# EAGLE design Atmega32_test (EAGLE 6.5.0)
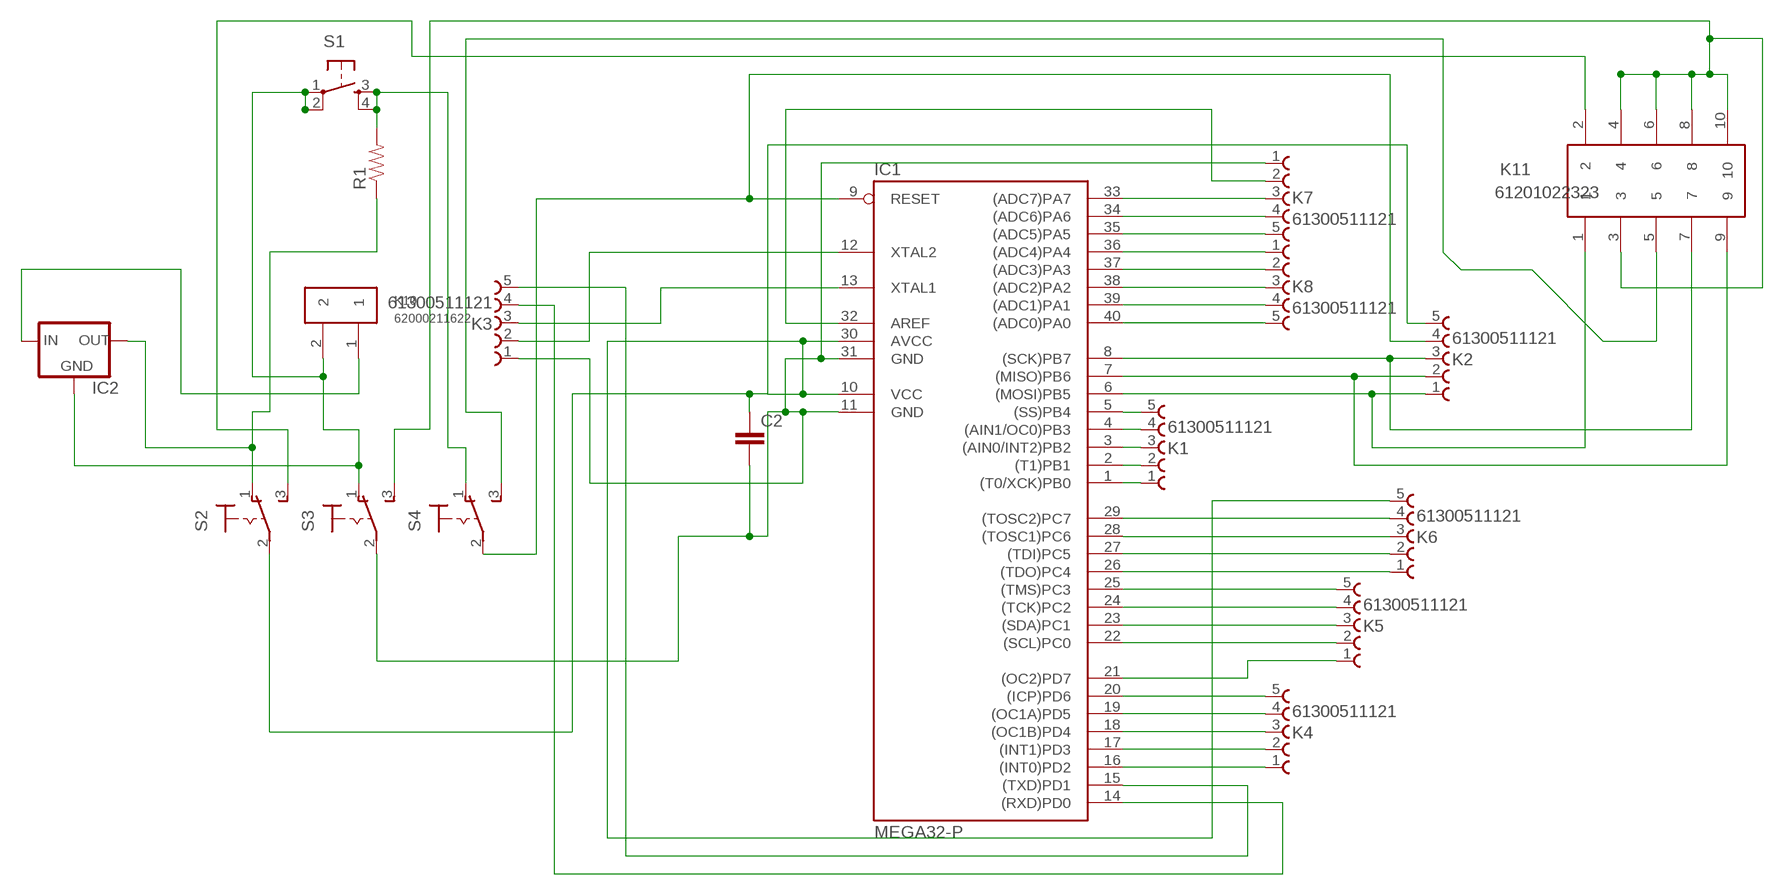
[diagram p0: schematic, sheet 1]

## Parts
C2  C10/6  [C10B6]
IC1  MEGA32-P  [DIL40]
IC2  V_REG_78XX-TO-220  [TO-220-ALT]
K1  61300511121  [61300511121]
K2  61300511121  [61300511121]
K3  61300511121  [61300511121]
K4  61300511121  [61300511121]
K5  61300511121  [61300511121]
K6  61300511121  [61300511121]
K7  61300511121  [61300511121]
K8  61300511121  [61300511121]
K10  62000211622  [62000211622]
K11  61201022323  [61201022323]
R1  10KOHM1/6W5%(PTH)KIT  [AXIAL-0.3-KIT]
S1  TAC_SWITCHPTH  [TACTILE-PTH]
S2  320-916  [320-916]
S3  320-916  [320-916]
S4  320-916  [320-916]

## Nets
N$1: IC1.12(XTAL2) K3.2
N$2: IC1.26((TDO)PC4) K6.1
N$3: IC1.1((T0/XCK)PB0) K1.1
N$4: IC1.5((SS)PB4) K1.5
N$5: IC1.3((AIN0/INT2)PB2) K1.3
N$6: IC1.4((AIN1/OC0)PB3) K1.4
N$7: IC1.2((T1)PB1) K1.2
N$8: IC1.6((MOSI)PB5) K2.1 K11.1
N$9: IC1.7((MISO)PB6) K2.2 K11.9
N$10: IC1.8((SCK)PB7) K2.3 K11.7
N$11: IC1.39((ADC1)PA1) K8.4
N$12: C2.2 IC1.11(GND) IC1.31(GND) K3.1 K7.1 S3.2(P)
N$13: IC1.9(RESET) K2.4 S4.2(P)
N$14: K11.2 S2.3(S)
N$15: IC1.14((RXD)PD0) K3.4
N$16: IC2.IN K10.1
N$17: IC1.17((INT1)PD3) K4.2
N$18: IC1.16((INT0)PD2) K4.1
N$19: IC1.18((OC1B)PD4) K4.3
N$20: IC1.19((OC1A)PD5) K4.4
N$21: IC1.20((ICP)PD6) K4.5
N$22: IC1.21((OC2)PD7) K5.1
N$23: IC1.22((SCL)PC0) K5.2
N$24: IC1.23((SDA)PC1) K5.3
N$25: IC1.24((TCK)PC2) K5.4
N$26: IC1.25((TMS)PC3) K5.5
N$27: IC1.27((TDI)PC5) K6.2
N$28: IC1.28((TOSC1)PC6) K6.3
N$29: IC1.29((TOSC2)PC7) K6.4
N$31: IC1.13(XTAL1) K3.3
N$32: IC1.32(AREF) K7.2
N$34: IC1.36((ADC4)PA4) K8.1
N$35: IC1.33((ADC7)PA7) K7.3
N$36: IC1.34((ADC6)PA6) K7.4
N$37: IC1.35((ADC5)PA5) K7.5
N$38: IC1.37((ADC3)PA3) K8.2
N$39: IC1.38((ADC2)PA2) K8.3
N$40: IC1.40((ADC0)PA0) K8.5
N$41: IC2.OUT R1.P$1 S2.1(O)
N$42: R1.P$2 S1.3 S1.4 S4.1(O)
N$43: K11.3 K11.4 K11.6 K11.8 K11.10 S3.3(S)
N$44: IC2.GND K10.2 S1.1 S1.2 S3.1(O)
N$45: K11.5 S4.3(S)
N$46: IC1.15((TXD)PD1) K3.5
N$48: C2.1 IC1.10(VCC) IC1.30(AVCC) K2.5 K6.5 S2.2(P)

## Library data of the parts
C2 = capacitor-wima:C: CAPACITOR naming: grid - package width
IC1 = atmel:MEGA32-P: MICROCONTROLLER 32 Kbytes FLASH 2 Kbytes SRAM 1 Kbytes EEPROM USART 8-channel 10 bit ADC Source: www.atmel.com .. doc2503.pdf; MPN: ATMEGA32-16PU; OC_FARNELL: 1661729; OC_NEWARK: 51P1794
IC2 = SparkFun-PowerIC:V_REG_78XX: Voltage Regulator Standard 7805 5V regulator. IGO (Input Ground Output). Spark Fun Electronics SKU : COM-00107
K1-K8 = Wuerth_Elektronik_eiCan_01_Pin__Socked_Headers_v1_3:61300511121: WR-PHD 2.54mm Pin Header, 5 Pin
K10 = Wuerth_Elektronik_eiCan_09_Wire_to_Board_Connectors:62000211622: WR-WTB 2.00mm Male Vertical Shrouded Header, 2 Pins
K11 = Wuerth_Elektronik_eiCan_05_Box_Header_IDC_Connectors_1_2:61201022323: WR-BHD 2.54mm Board to Cable Transition Connector, 10 Pins
R1 = SparkFun-Resistors:10KOHM1/6W5%(PTH): RES-08375; PROD_ID: RES-08375
S1 = SparkFun-Electromechanical:TAC_SWITCH: Momentary Switch Button commonly used for reset or general input. Spark Fun Electronics SKU : COM-00097 SMT- SWCH-08247
S2-S4 = switch:320-916: TOGGLE SWITCH distributor RS Components

## Board
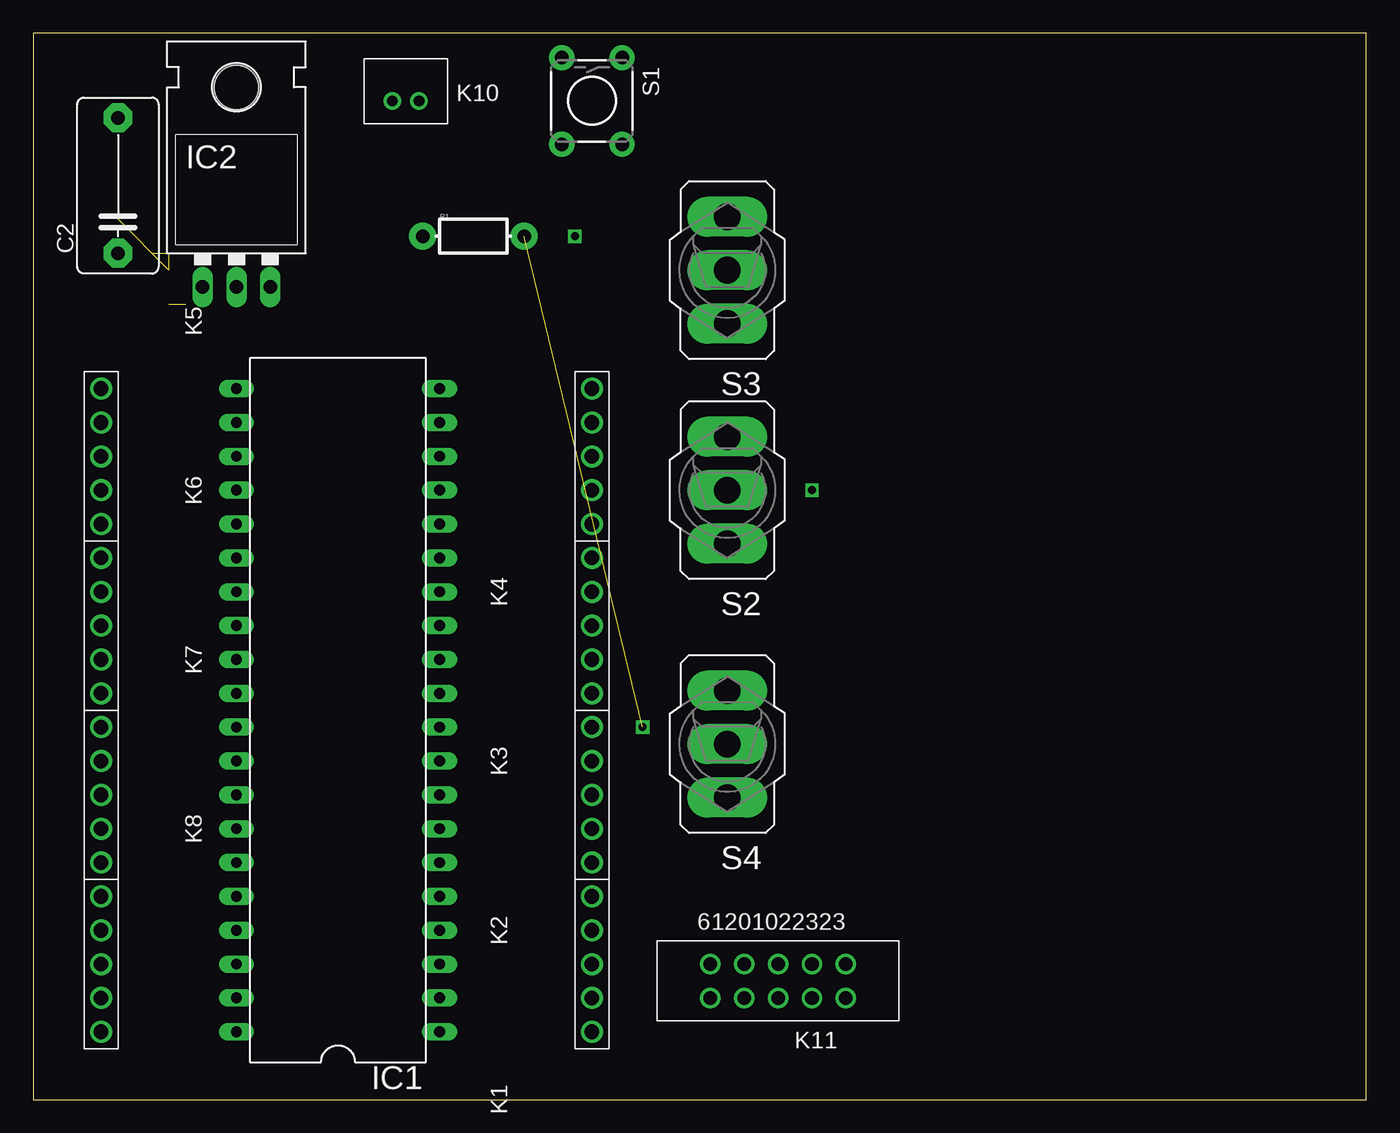
[diagram p1: board, top side]
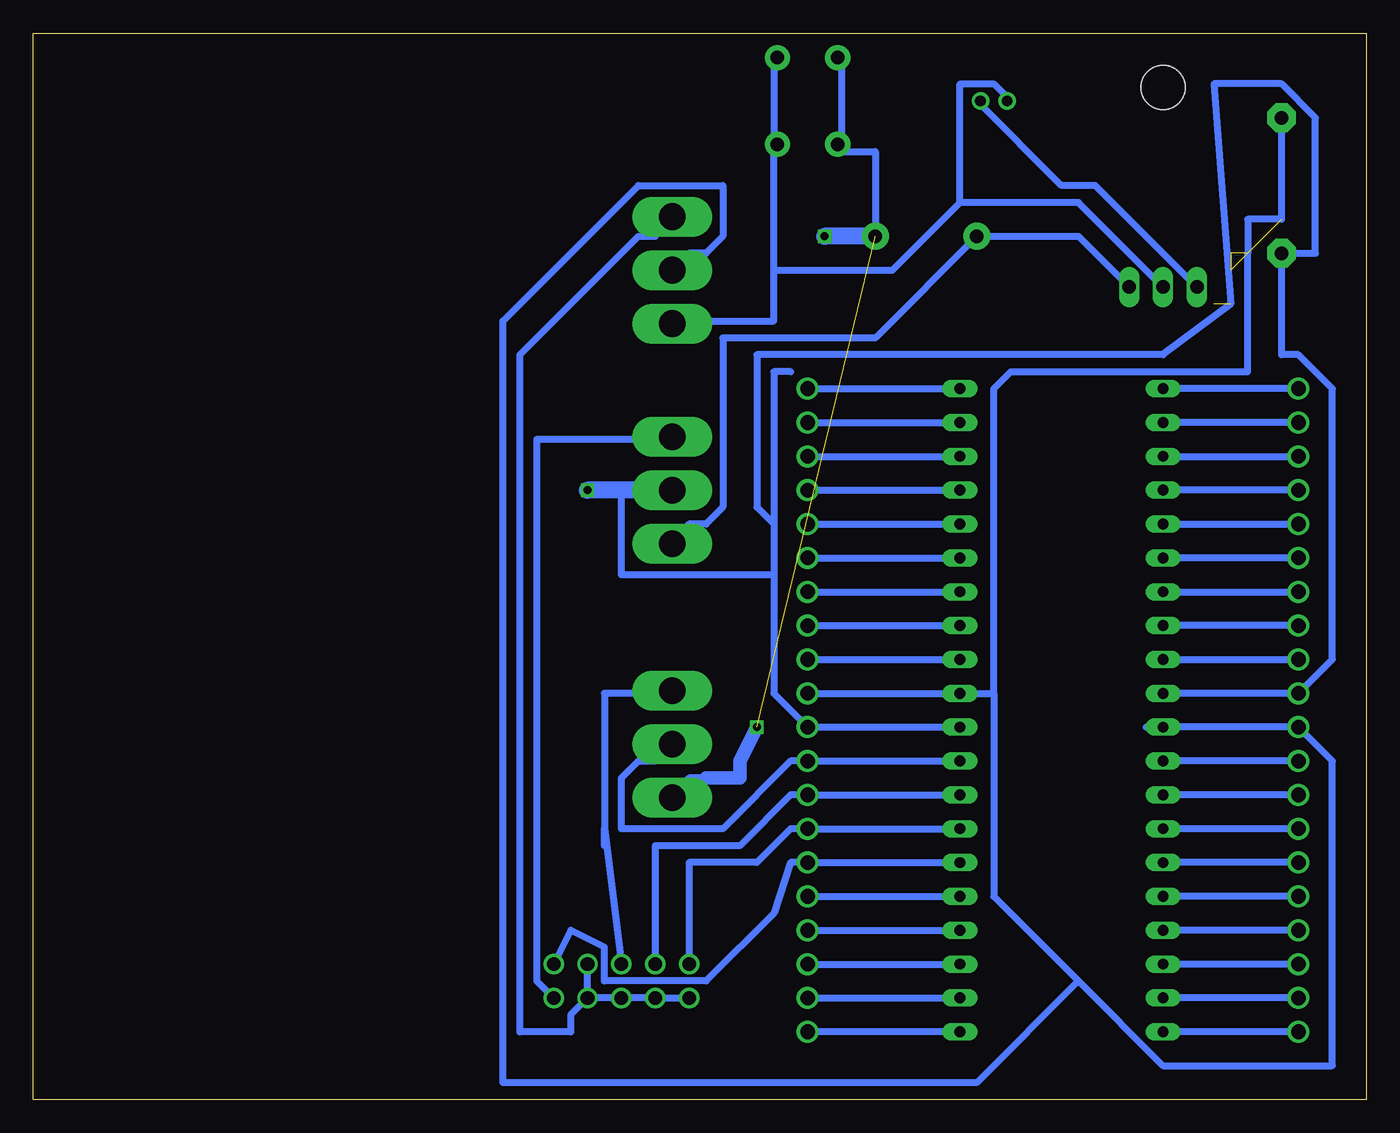
[diagram p2: board, bottom side, seen from below]

Size 100 x 80 mm. Coordinates in mm from the lower left corner, seen from the top.
Outline: 0,0 100,0 100,80 0,80 0,0
Copper layers (1*16): Top 0.035mm / dielectric 1.5mm / Bottom 0.035mm
Design rules "default *": minimum track width 20mil, minimum drill 24mil, track to track 15mil, track to pad 8mil, pad to pad 8mil, via to via 8mil, smd to smd 8mil, copper to edge 40mil, drill to drill 8mil, minimum pad ring 10mil, minimum via ring 8mil, stop-mask expansion 4mil, vias tented up to drill 0mil, thermal gap 10mil

### Footprints (pad centres in the part's own frame; a part is rotated, then mirrored left to right if it is on the bottom)
C10B6 = drill 1.016 pad 2.159 octagon: 1 -5.08,0; 2 5.08,0
DIL40 = drill 0.813 long: 1 -24.13,-7.62; 2 -21.59,-7.62; 3 -19.05,-7.62; 4 -16.51,-7.62; 5 -13.97,-7.62; 6 -11.43,-7.62; 7 -8.89,-7.62; 8 -6.35,-7.62; 9 -3.81,-7.62; 10 -1.27,-7.62; 11 1.27,-7.62; 12 3.81,-7.62; 13 6.35,-7.62; 14 8.89,-7.62; 15 11.43,-7.62; 16 13.97,-7.62; 17 16.51,-7.62; 18 19.05,-7.62; 19 21.59,-7.62; 20 24.13,-7.62; 21 24.13,7.62; 22 21.59,7.62; 23 19.05,7.62; 24 16.51,7.62; 25 13.97,7.62; 26 11.43,7.62; 27 8.89,7.62; 28 6.35,7.62; 29 3.81,7.62; 30 1.27,7.62; 31 -1.27,7.62; 32 -3.81,7.62; 33 -6.35,7.62; 34 -8.89,7.62; 35 -11.43,7.62; 36 -13.97,7.62; 37 -16.51,7.62; 38 -19.05,7.62; 39 -21.59,7.62; 40 -24.13,7.62
TO-220-ALT = drill 1.016 long: GND 0,-3.81; IN -2.54,-3.81; OUT 2.54,-3.81 | hole 3.302: 0,11.176
61300511121 = drill 1.1: 1 -5.08,0; 2 -2.54,0; 3 0,0; 4 2.54,0; 5 5.08,0
62000211622 = drill 0.8: 1 1,0; 2 -1,0
61201022323 = drill 1.02: 1 -2.54,-1.27; 2 -2.54,1.27; 3 0,-1.27; 4 0,1.27; 5 2.54,-1.27; 6 2.54,1.27; 7 5.08,-1.27; 8 5.08,1.27; 9 7.62,-1.27; 10 7.62,1.27
AXIAL-0.3-KIT = drill 1.016 pad 2.032: P$1 -3.81,0; P$2 3.81,0
TACTILE-PTH = drill 1.016 pad 1.88: 1 -3.251,2.261; 2 3.251,2.261; 3 -3.251,-2.261; 4 3.251,-2.261
320-916 = drill 2.007 long: 1 0,4.013; 2 0,0; 3 0,-4.013

### Placement (x,y rotation side)
C2  6.35,68.58 90 top
IC1  22.86,29.21 90 top
IC2  15.24,64.77 0 top
K1  41.91,10.16 90 top
K2  41.91,22.86 90 top
K3  41.91,35.56 90 top
K4  41.91,48.26 90 top
K5  5.08,48.26 270 top
K6  5.08,35.56 270 top
K7  5.08,22.86 270 top
K8  5.08,10.16 270 top
K10  27.94,74.93 0 top
K11  58.42,8.89 180 top
R1  33.02,64.77 0 top
S1  41.91,74.93 270 top
S2  52.07,45.72 180 top
S3  52.07,62.23 180 top
S4  52.07,26.67 180 top

### Tracks (layer width: path | path; a pad name or v marks a point on that pad's centre or on a via)
N$1
  Bottom 0.508: K3.2 IC1.12
N$2
  Bottom 0.508: K6.1 IC1.26
N$3
  Bottom 0.508: IC1.1 K1.1
N$4
  Bottom 0.508: K1.5 IC1.5
N$5
  Bottom 0.508: K1.3 IC1.3
N$6
  Bottom 0.508: K1.4 IC1.4
N$7
  Bottom 0.508: K1.2 IC1.2
N$8
  Bottom 0.508: IC1.6 K2.1 43.18,17.78 44.45,13.97 49.53,8.89 57.15,8.89 57.15,11.43 59.69,12.7 K11.1
N$9
  Bottom 0.508: IC1.7 K2.2 43.18,20.32 45.72,17.78 50.8,17.78 K11.9
N$10
  Bottom 0.508: IC1.8 K2.3 43.18,22.86 46.99,19.05 53.34,19.05 K11.7
N$11
  Bottom 0.508: K8.4 IC1.39
N$12  (3 unrouted)
  Bottom 0.508: K3.1 IC1.11 27.94,30.48 | 21.59,8.89 27.94,15.24 27.94,30.48 | 21.59,8.89 15.24,2.54 2.54,2.54 2.54,25.4 K7.1 IC1.31 16.51,27.94 | 21.59,8.89 29.21,1.27 64.77,1.27 64.77,58.42 54.61,68.58 48.26,68.58 48.26,64.77 49.53,63.5 50.8,63.5 S3.2 | 27.94,30.48 27.94,53.34 26.67,54.61 8.89,54.61 8.89,63.5 8.89,66.04 6.35,66.04 C2.2
N$13
  Bottom 0.508: IC1.9 K2.4 43.18,25.4 48.26,20.32 55.88,20.32 55.88,24.13 54.61,25.4 53.34,25.4 S4.2
N$14
  Bottom 0.508: K11.2 62.23,8.89 62.23,49.53 52.07,49.53 S2.3
N$15
  Bottom 0.508: K3.4 IC1.14
N$16
  Bottom 0.508: IC2.IN 20.32,68.58 22.86,68.58 29.21,74.93 K10.1
N$17
  Bottom 0.508: K4.2 IC1.17
N$18
  Bottom 0.508: K4.1 IC1.16
N$19
  Bottom 0.508: K4.3 IC1.18
N$20
  Bottom 0.508: K4.4 IC1.19
N$21
  Bottom 0.508: K4.5 IC1.20
N$22
  Bottom 0.508: K5.1 IC1.21
N$23
  Bottom 0.508: K5.2 IC1.22
N$24
  Bottom 0.508: IC1.23 K5.3
N$25
  Bottom 0.508: K5.4 IC1.24
N$26
  Bottom 0.508: IC1.25 K5.5
N$27
  Bottom 0.508: IC1.27 K6.2
N$28
  Bottom 0.508: K6.3 IC1.28
N$29
  Bottom 0.508: IC1.29 K6.4
N$31
  Bottom 0.508: K3.3 IC1.13
N$32
  Bottom 0.508: K7.2 IC1.32
N$34
  Bottom 0.508: K8.1 IC1.36
N$35
  Bottom 0.508: K7.3 IC1.33
N$36
  Bottom 0.508: K7.4 IC1.34
N$37
  Bottom 0.508: K7.5 IC1.35
N$38
  Bottom 0.508: K8.2 IC1.37
N$39
  Bottom 0.508: K8.3 IC1.38
N$40
  Bottom 0.508: K8.5 IC1.40
N$41
  Bottom 0.508: S2.1 52.07,41.91 50.8,43.18 49.53,43.18 48.26,44.45 48.26,57.15 36.83,57.15 R1.P$1 21.59,64.77 IC2.OUT
N$42  (via drill 0.6)  (1 unrouted)
  Bottom 0.508: 49.53,24.13 50.8,24.13 52.07,22.86 S4.1 | S1.3 39.37,77.47 39.37,72.39 S1.4 39.37,71.12 36.83,71.12 R1.P$2
  Bottom 1.016: v45.72,27.94 46.99,25.4 46.99,24.13 49.53,24.13
  Bottom 1.27: R1.P$2 v40.64,64.77
N$43
  Bottom 0.508: K11.10 K11.8 K11.6 K11.4 | K11.4 K11.3 | K11.4 59.69,6.35 59.69,5.08 63.5,5.08 63.5,55.88 54.61,64.77 53.34,64.77 52.07,66.04 S3.3
N$44
  Bottom 0.508: 30.48,67.31 30.48,76.2 27.94,76.2 26.67,74.93 K10.2 | 30.48,67.31 21.59,67.31 IC2.GND | S1.1 44.45,77.47 44.45,72.39 S1.2 44.45,71.12 44.45,62.23 | 44.45,62.23 44.45,58.42 52.07,58.42 S3.1 | 30.48,67.31 35.56,62.23 44.45,62.23
N$45
  Bottom 0.508: 57.15,19.05 57.15,20.32 | 57.15,20.32 K11.5 | 57.15,20.32 57.15,30.48 52.07,30.48 S4.3
N$46
  Bottom 0.508: K3.5 IC1.15
N$48  (via drill 0.6)  (1 unrouted)
  Bottom 0.508: IC1.10 K2.5 44.45,30.48 44.45,39.37 | 43.18,54.61 44.45,54.61 44.45,43.18 | 44.45,43.18 44.45,39.37 | IC1.30 K6.5 2.54,33.02 2.54,53.34 5.08,55.88 6.35,55.88 C2.1 3.81,63.5 3.81,73.66 6.35,76.2 11.43,76.2 10.16,59.69 15.24,55.88 45.72,55.88 45.72,44.45 44.45,43.18 | 55.88,45.72 55.88,39.37 44.45,39.37
  Bottom 1.27: S2.2 55.88,45.72 v58.42,45.72